# EAGLE design DIY BMSP Ver 3.0 (EAGLE 7.5.0)
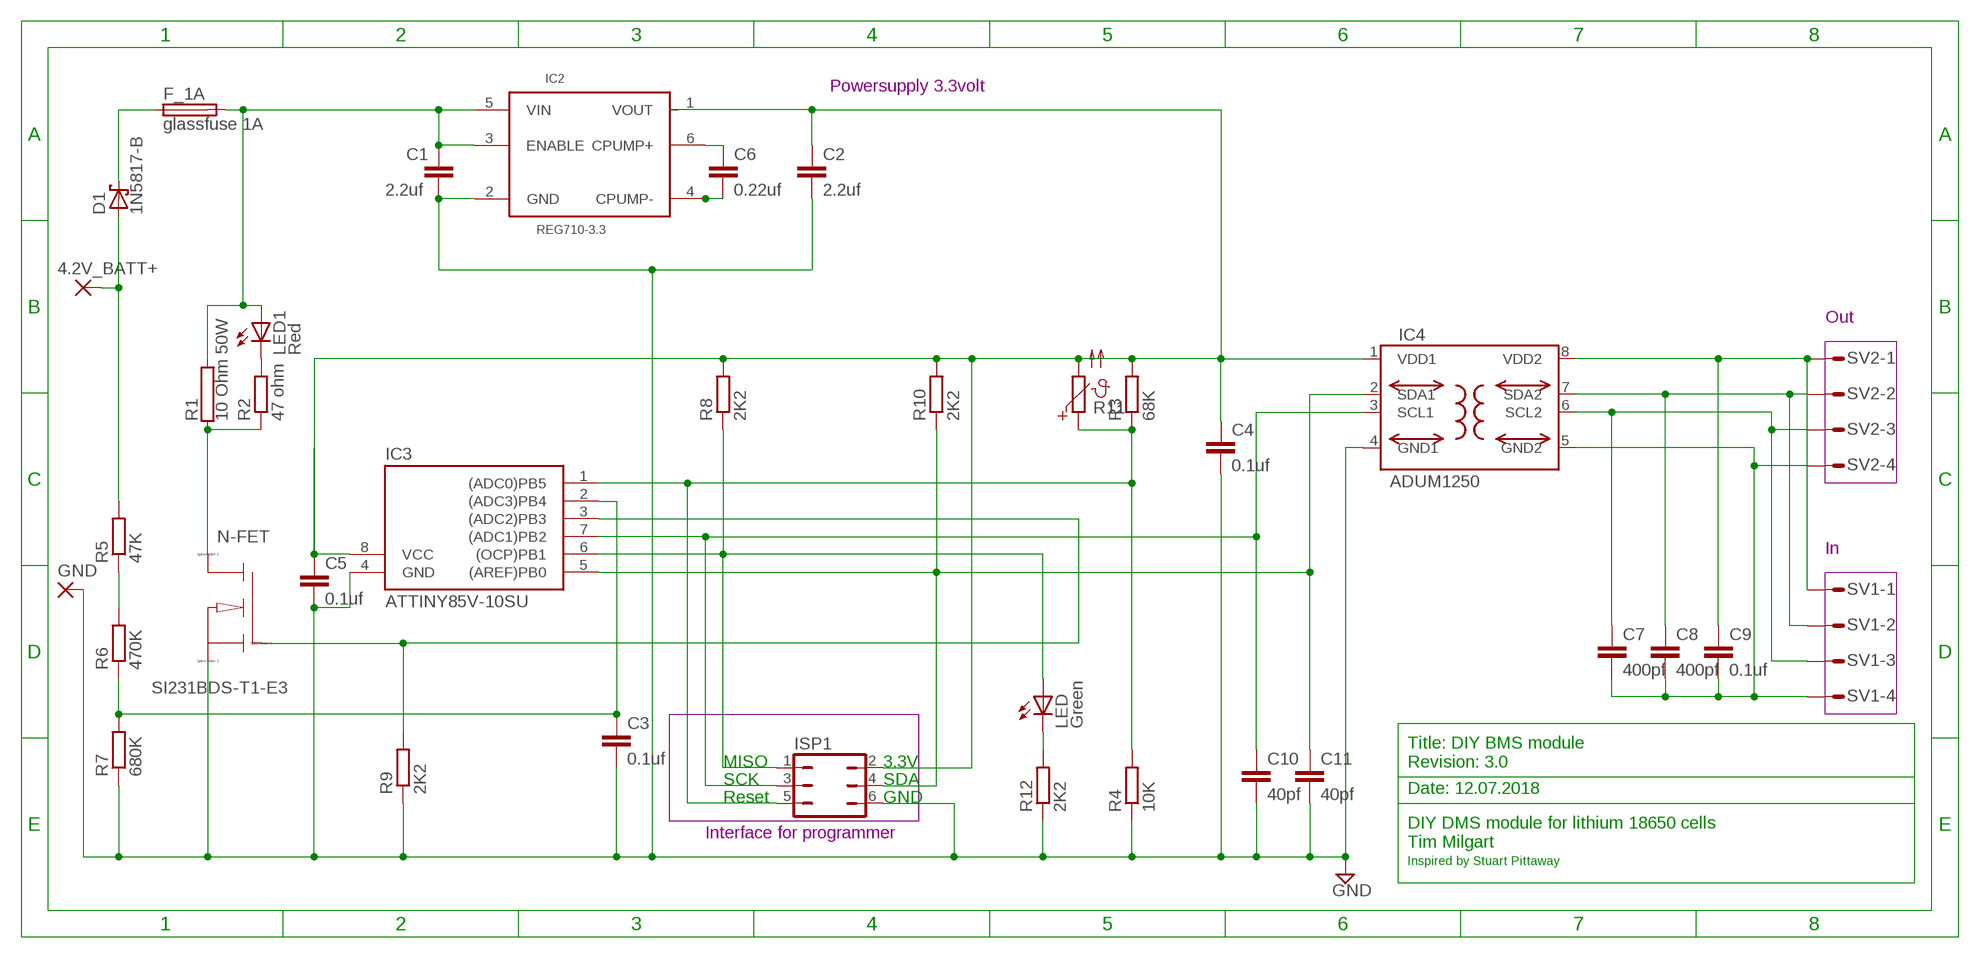
[diagram p0: schematic, sheet 1]

## Parts
4.2V_BATT+  3,17/1,3  [3,17/1,3]
C1  2.2uf  C-EU050-025X075  [C050-025X075]
C2  2.2uf  C-EU050-025X075  [C050-025X075]
C3  0.1uf  C-EU050-025X075  [C050-025X075]
C4  0.1uf  C-EU050-025X075  [C050-025X075]
C5  0.1uf  C-EU050-025X075  [C050-025X075]
C6  0.22uf  C-EU050-025X075  [C050-025X075]
C7  400pf  C-EU050-024X044  [C050-024X044]
C8  400pf  C-EU050-024X044  [C050-024X044]
C9  0.1uf  C-EU050-025X075  [C050-025X075]
C10  40pf  C-EU050-024X044  [C050-024X044]
C11  40pf  C-EU050-024X044  [C050-024X044]
D1  1N5817-B  [DO41-7.6]
F_1A  glassfuse 1A  FUSEPICOFUSE  [PICOFUSE]
GND  3,17/1,3  [3,17/1,3]
IC2  REG710-3.3  REG710NA(SOT23-6)  [SOT-23-6]
IC3  ATTINY85V-10SU  TINY15LP  [DIL08]
IC4  ADUM1250  [SO8-COOL]
ISP1  JP3Q  [JP3Q]
LED  Green  TLLG4400  [LED3MM]
LED1  Red  TLLG4400  [LED3MM]
N-FET  SI231BDS-T1-E3  NMOS  [SOT23]
R1  10 Ohm 50W  RHPS947  [HPS947]
R2  47 ohm  R-EU_0207/10  [0207/10]
R3  68K  R-EU_0207/10  [0207/10]
R4  10K  R-EU_0207/10  [0207/10]
R5  47K  R-EU_0207/10  [0207/10]
R6  470K  R-EU_0207/10  [0207/10]
R7  680K  R-EU_0207/10  [0207/10]
R8  2K2  R-EU_0207/10  [0207/10]
R9  2K2  R-EU_0207/10  [0207/10]
R10  2K2  R-EU_0207/10  [0207/10]
R11  PTC679  [P679]
R12  2K2  R-EU_0207/10  [0207/10]
SV1  L04P  [L04P]
SV2  L04P  [L04P]

## Nets
GND1: C1.2 C2.2 C3.2 C4.2 C5.2 C10.2 C11.2 GND.1(P) IC3.4(GND) IC4.4(GND1) ISP1.6 N-FET.2(S) R4.1 R7.1 R9.1 R12.1 ; supply symbol labelled GND
GND2: C7.2 C8.2 C9.2 IC4.5(GND2) SV1.4 SV2.4
N$1: 4.2V_BATT+.1(P) D1.A R5.2
N$4: D1.C F_1A.1
N$5: C8.1 IC4.7(SDA2) SV1.2 SV2.2
N$6: C6.1 IC2.6(CPUMP+)
N$7: C7.1 IC4.6(SCL2) SV1.3 SV2.3
N$9: IC3.3((ADC2)PB3) N-FET.1(G) R9.2
N$10: LED.K(C) R12.2
N$11: C10.1 IC3.7((ADC1)PB2) IC4.3(SCL1) ISP1.3
N$12: C3.1 IC3.2((ADC3)PB4) R6.1 R7.2
N$13: C11.1 IC3.5((AREF)PB0) IC4.2(SDA1) ISP1.4 R10.1
N$14: R5.1 R6.2
N$15: C6.2 IC2.4(CPUMP-)
N$16: IC3.6((OCP)PB1) ISP1.1 LED.A R8.1
N$17: IC3.1((ADC0)PB5) ISP1.5 R3.1 R4.2 R11.1
N$47: N-FET.3(D) R1.1 R2.1
N$52: LED1.K(C) R2.2
N$53: C1.1 F_1A.2 IC2.3(ENABLE) IC2.5(VIN) LED1.A R1.2
VDD1: C2.1 C4.1 C5.1 IC3.8(VCC) IC4.1(VDD1) ISP1.2 R3.2 R8.2 R10.2 R11.2
VDD2: C9.1 IC4.8(VDD2) SV1.1 SV2.1
Unconnected: IC2.1(VOUT)

## Notes on the sheet
- Powersupply 3.3volt
- Out
- In
- MISO | 3.3V
- Title: DIY BMS module
  Revision: 3.0
- SCK | SDA
- Date: 12.07.2018
- Reset | GND
- Interface for programmer
- DIY DMS module for lithium 18650 cells
  Tim Milgart
- Inspired by Stuart Pittaway

## Power pins joined to a net without a drawn wire
GND1: IC2.2(GND)

## Library data of the parts
4.2V_BATT+ GND = wirepad:3,17/1,3: THROUGH-HOLE PAD
C1-C11 = rcl:C-EU: CAPACITOR, European symbol
D1 = diode:1N581*: 1.0A SCHOTTKY BARRIER RECTIFIER Source: http://www.diodes.com/datasheets/ds23001.pdf
F_1A = fuse:FUSE: Fuse; OC_FARNELL: unknown; OC_NEWARK: unknown
IC2 = Tim-ic2:REG710NA(SOT23-6): 3100302999; MPN: REG710NA
IC3 = atmel:TINY15L: MICROCONTROLLER 2.7 V 1 Kbytes FLASH 64 bytes EEPROM 4-channel 10 bit ADC; OC_FARNELL: unknown; OC_NEWARK: unknown
IC4 = analog-devices-3:ADUM1250: Hot Swappable, Dual I2C Isolators Source: http://www.analog.com/static/imported-files/data_sheets/ADUM1250_1251.pdf
ISP1 = jumper:JP3Q: JUMPER
LED LED1 = led:TLLG4400: Low Current (2mA) LED 3 mm Tinted Diffused Package color GREEN Source: Data sheet <http://www.farnell.com/datasheets/391098.pdf>; MF: VISHAY SEMICONDUCTOR; OC_FARNELL: 1612435
N-FET = sym:NMOS: N-Channel MOSFET transistor
R1 = resistor-power:R: Power Resitor; OC_FARNELL: unknown; OC_NEWARK: unknown
R2-R10 R12 = rcl:R-EU_: RESISTOR, European symbol
R11 = ptc-ntc:PTC679: PHILIPS PTC; OC_FARNELL: unknown; OC_NEWARK: unknown
SV1 SV2 = con-amp-mt:L04P: AMP MT CONNECTOR; OC_FARNELL: unknown; OC_NEWARK: unknown

## Board
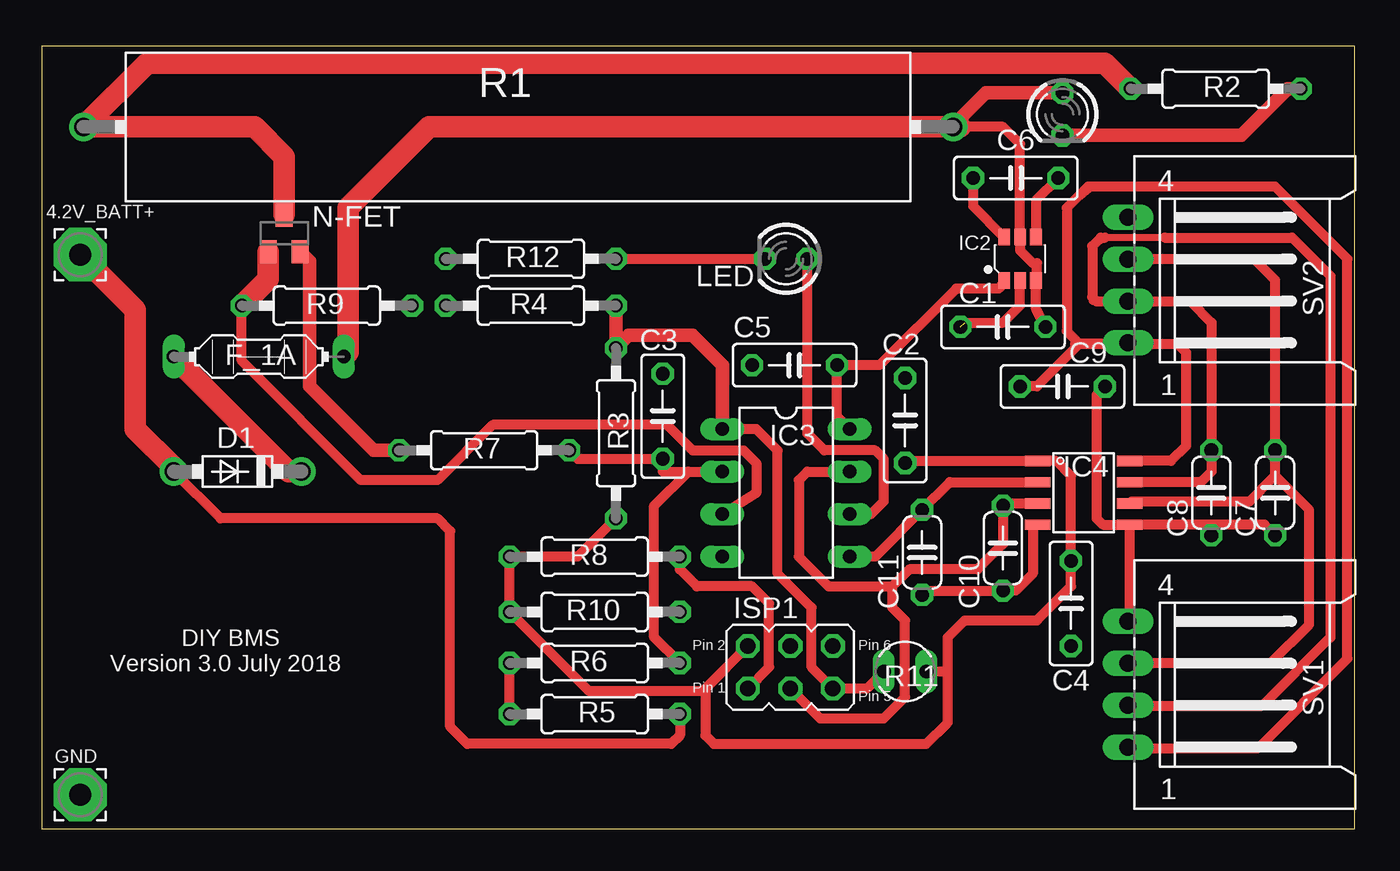
[diagram p1: board, top side]
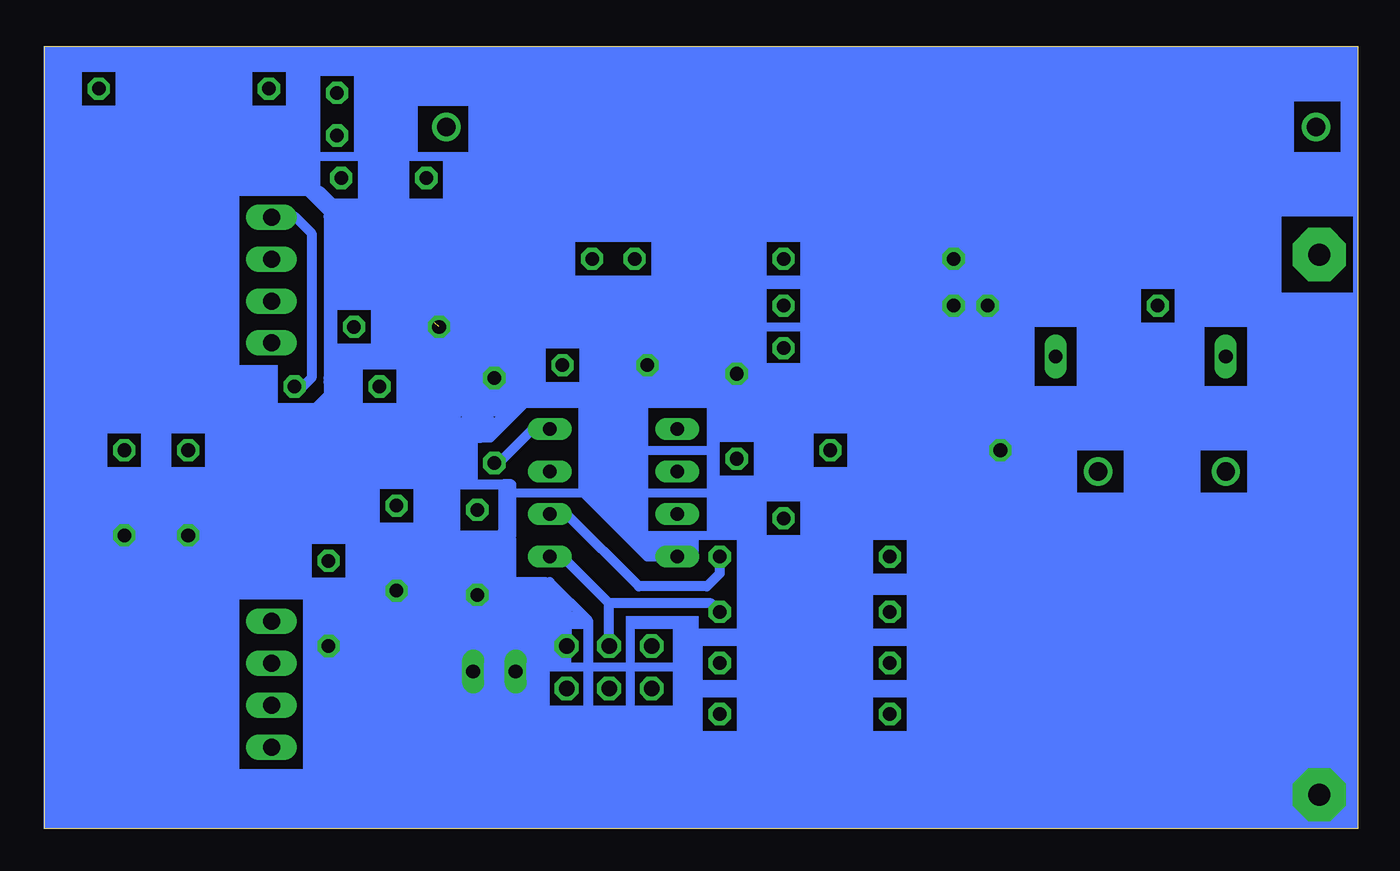
[diagram p2: board, bottom side, seen from below]

Size 78.41 x 46.73 mm. Coordinates in mm from the lower left corner, seen from the top.
Outline: 0,0 78.41,0 78.41,46.73 0,46.73 0,0
Copper layers (1*16): Top 0.035mm / dielectric 1.5mm / Bottom 0.035mm
Design rules "default": minimum track width 10mil, minimum drill 24mil, track to track 8mil, track to pad 8mil, pad to pad 8mil, via to via 8mil, smd to smd 8mil, copper to edge 40mil, drill to drill 8mil, minimum pad ring 10mil, minimum via ring 8mil, stop-mask expansion 4mil, vias tented up to drill 0mil, thermal gap 10mil

### Footprints (pad centres in the part's own frame; a part is rotated, then mirrored left to right if it is on the bottom)
3,17/1,3 = drill 1.321 pad 3.175 octagon: 1 0,0
C050-025X075 = drill 0.813 octagon: 1 -2.54,0; 2 2.54,0
C050-024X044 = drill 0.813 octagon: 1 -2.54,0; 2 2.54,0
DO41-7.6 = drill 1.1 pad 1.7: A 3.81,0; C -3.81,0
PICOFUSE = drill 0.813 long: 1 -5.08,0; 2 5.08,0
SOT-23-6 = smd 0.69 x 1: 1 -0.95,-1.3; 2 0,-1.3; 3 0.95,-1.3; 4 0.95,1.3; 5 0,1.3; 6 -0.95,1.3
DIL08 = drill 0.813 long: 1 -3.81,-3.81; 2 -1.27,-3.81; 3 1.27,-3.81; 4 3.81,-3.81; 5 3.81,3.81; 6 1.27,3.81; 7 -1.27,3.81; 8 -3.81,3.81
SO8-COOL = smd 0.61 x 1.524: 1 -1.905,-2.743; 2 -0.635,-2.743; 3 0.635,-2.743; 4 1.905,-2.743; 5 1.905,2.743; 6 0.635,2.743; 7 -0.635,2.743; 8 -1.905,2.743
JP3Q = drill 0.914 octagon: 1 -2.54,-1.27; 2 -2.54,1.27; 3 0,-1.27; 4 0,1.27; 5 2.54,-1.27; 6 2.54,1.27
LED3MM = drill 0.813 octagon: A -1.27,0; K 1.27,0
SOT23 = smd 1 x 1.4: 1 -0.95,-1.1; 2 0.95,-1.1; 3 0,1.1
HPS947 = drill 1.1 pad 1.7: 1 -25.97,0; 2 25.97,0
0207/10 = drill 0.813 octagon: 1 -5.08,0; 2 5.08,0
P679 = drill 0.813 long: 1 -1.27,0; 2 1.27,0
L04P = drill 1.016 long: 1 3.75,-6.25; 2 1.25,-6.25; 3 -1.25,-6.25; 4 -3.75,-6.25

### Placement (x,y rotation side)
4.2V_BATT+  2.29,34.29 0 top
C1  57.4,29.97 180 top
C2  51.56,24.38 90 top
C3  37.08,24.64 90 top
C4  61.47,13.46 270 top
C5  44.96,27.69 180 top
C6  58.17,38.86 0 top
C7  73.66,20.07 270 top
C8  69.85,20.07 270 top
C9  60.96,26.42 0 top
C10  57.4,16.76 270 top
C11  52.58,16.51 270 top
D1  11.68,21.34 180 top
F_1A  12.95,28.19 0 top
GND  2.29,2.03 0 top
IC2  58.42,34.04 0 top
IC3  44.45,20.07 270 top
IC4  62.23,20.07 270 top
ISP1  44.7,9.65 0 top
LED  44.45,34.04 180 top
LED1  60.96,42.67 270 top
N-FET  14.48,35.56 0 top
R1  28.45,41.91 0 top
R2  70.1,44.2 0 top
R3  34.29,23.62 270 top
R4  29.21,31.24 0 top
R5  33.02,6.86 0 top
R6  33.02,9.91 180 top
R7  26.42,22.61 0 top
R8  33.02,16.26 180 top
R9  17.02,31.24 180 top
R10  33.02,12.95 180 top
R11  51.56,9.4 0 top
R12  29.21,34.04 0 top
SV1  71.12,8.64 270 top
SV2  71.12,32.77 270 top

### Tracks (layer width: path | path; a pad name or v marks a point on that pad's centre or on a via)
GND1  (1 unrouted)
  Top 0.61: 55.12,30.23 57.4,30.23 58.42,31.24 IC2.2 | C11.2 52.83,14.22 C10.2 58.17,14.22 59.18,15.24 59.18,18.16 IC4.4
  Top 0.813: N-FET.2 16,33.89 16,26.42 19.81,22.61 R7.1
  Bottom 0.61: C3.2 40.89,29.21 C5.2 42.93,27.69 43.18,27.43 | IC3.4 42.42,16.26 42.67,16.51 | 42.67,16.51 43.18,17.02 | 43.18,17.02 43.18,27.43 | 43.18,27.43 45.47,29.72 52.32,29.72 52.58,29.97 C1.2 | C10.2 58.17,14.22 C4.2 61.47,13.97 61.98,14.48 63.5,14.48 63.75,14.73 63.75,17.53 63.5,17.78 61.98,17.78 61.47,18.29 61.47,23.37 54.36,23.37 53.85,23.88 | 43.18,17.02 45.97,19.81 | 45.97,19.81 45.97,20.07 45.72,19.81 45.21,19.81 | 45.21,19.81 45.72,20.32 45.72,25.91 51.56,25.91 | 51.56,25.91 51.82,25.91 53.85,23.88 | 42.67,25.65 42.67,16.51 | 45.97,19.81 46.23,20.07 46.23,25.4 | 43.94,18.54 45.21,19.81 | 45.21,19.81 45.21,20.32 43.94,19.05 | 42.67,20.07 42.67,16.76 43.94,18.03 43.94,19.05 | 43.94,19.05 43.69,19.05 43.43,18.8 43.43,18.03 | 43.94,19.05 43.69,19.3 43.69,19.81 44.2,19.81 | C2.2 51.56,25.91 | ISP1.6 52.58,10.92 C11.2 | 47.24,12.7 47.24,13.46 48.51,14.73 | 47.24,12.45 47.24,11.18 | 47.24,11.18 ISP1.6 | ISP1.6 47.75,11.43 47.75,13.46 48.51,14.22 48.51,11.43 48.26,11.43 48.01,11.68 48.01,13.46 | 47.24,11.18 49.02,9.4 | ISP1.6 49.28,8.89 | 48.51,14.73 50.55,14.73 50.55,17.27 53.85,17.27 53.85,17.53 50.55,17.53 50.55,20.57 51.05,20.57 | 53.85,20.57 51.05,20.57 | 51.05,20.57 51.05,17.78 | 48.51,14.73 48.26,14.73 45.97,12.45 45.97,7.11 | 46.23,12.45 47.24,12.45 | 47.24,12.45 47.24,12.7 | 47.24,12.7 46.74,12.7 | 52.07,24.38 53.34,23.11 53.09,23.11 52.83,23.37 | 52.83,23.37 51.82,24.38 | 49.53,25.65 51.82,23.37 52.32,23.37 | 52.83,23.37 52.32,23.37 | 52.32,23.37 50.8,24.89 50.8,25.15 51.05,24.89 52.58,24.89 | 52.58,24.89 53.34,24.13 53.09,23.88 52.83,23.88 52.32,24.38 52.32,24.64 52.58,24.89 | 52.58,24.89 54.1,24.89 54.36,24.64 54.36,24.13 54.1,23.88 53.85,23.88
  Bottom 0.61: 53.85,23.88 53.85,24.64
  Bottom 0.813: GND.1 17.02,16.76 17.02,19.81 19.81,22.61 R7.1
  Bottom 1.27: R12.1 R4.1 | R4.1 R9.1 21.34,30.48 R7.1 | C3.2 24.13,27.18 R4.1
GND2
  Top 0.61: C7.2 73.03,18.16 IC4.5 | 63.25,26.42 C9.2 62.99,25.91 62.99,18.54 63.37,18.16 IC4.5 | SV1.4 64.97,12.49 IC4.5
  Bottom 0.61: SV2.4 64.81,36.58 63.5,36.58 62.48,35.56 62.48,26.92 62.99,26.42 C9.2
  Bottom 1.27: C8.2 C7.2
N$1
  Top 0.61: R5.2 38.1,5.59 37.59,5.08 25.4,5.08 24.38,6.1 24.38,17.78 23.62,18.54 10.67,18.54 D1.A
  Top 1.27: 4.2V_BATT+.1 5.59,30.99 5.59,23.88 7.87,21.59 D1.A
N$4
  Top 1.27: F_1A.1 14.73,21.34 D1.C
N$5
  Top 0.406: 67.06,35.31 63.5,35.31 62.74,34.8 | 62.74,31.75 62.72,31.52 SV2.2
  Top 0.61: IC4.7 69.22,20.7 69.85,21.34 C8.1 69.85,30.23 68.58,31.5 64.89,31.5 SV2.2 | SV1.2 64.89,7.37 72.9,7.37 76.96,11.43 76.96,33.02 74.68,35.31 67.06,35.31 | 64.77,31.5 62.99,31.5 62.74,31.75 62.74,34.8 63.25,35.31 63.5,35.31
N$6
  Top 0.61: IC2.6 55.63,37.18 C6.1
N$7
  Top 0.406: 75.69,19.05 73.79,20.95 73.53,20.95
  Top 0.61: IC4.6 65.1,19.56 72.14,19.56 73.53,20.95 73.66,21.08 | SV2.3 72.41,34.02 73.66,32.77 C7.1 73.66,21.59 73.66,21.08 | SV1.3 64.89,9.91 73.41,9.91 75.69,12.19 75.69,19.05 73.66,21.08
N$9
  Top 0.61: 40.89,19.05 IC3.3 42.67,20.07 42.67,21.84 41.91,22.61 38.86,22.61 37.34,24.13 26.92,24.13 23.62,20.83 19.05,20.83 11.94,27.94 R9.2
  Top 1.27: R9.2 13.53,32.83 N-FET.1
N$10
  Top 0.61: R12.2 LED.K
N$11
  Top 0.61: IC3.7 45.72,21.34 45.21,20.83 45.21,16.26 46.99,14.48 50.8,14.48 | 50.8,14.48 51.82,15.49 55.88,15.49 57.4,17.02 C10.1 57.53,19.43 IC4.3 | ISP1.3 46.48,6.6 50.29,6.6 51.56,7.87 51.56,12.45 50.8,13.21 50.8,14.48
N$12
  Top 0.61: 38.61,21.34 37.08,21.34 C3.1 32,22.1 R7.2 | 38.61,21.34 IC3.2 | R6.1 36.58,11.43 36.58,19.3 38.61,21.34
N$13
  Top 0.61: IC3.5 49.78,16.26 C11.1 54.23,20.7 IC4.2
  Bottom 0.61: R10.1 38.61,13.46 44.7,13.46 | 44.7,13.46 47.5,16.26 IC3.5 | ISP1.4 44.7,13.46
N$14
  Top 0.61: R5.1 R6.2
N$15
  Top 0.61: C6.2 59.37,37.53 IC2.4
N$16
  Top 0.61: IC3.6 49.53,18.8 50.29,19.56 50.29,22.1 49.78,22.61 46.74,22.61 45.72,23.62 LED.A | ISP1.1 43.43,9.65 43.43,13.46 42.42,14.48 39.12,14.48 38.1,15.49 R8.1
  Bottom 0.61: R8.1 38.1,15.24 38.86,14.48 42.93,14.48 47.24,18.8 IC3.6
N$17
  Top 0.61: IC3.1 42.67,23.88 43.94,22.61 43.94,15.24 45.97,13.21 45.97,9.65 ISP1.5 49.28,8.38 R11.1
  Top 0.813: R4.2 R3.1 35.05,29.46 38.86,29.46 40.64,27.69 IC3.1
N$18
  Bottom 0.61: 68.07,38.1 62.74,38.1 | 62.74,38.1 61.98,38.1 60.71,36.83 60.96,36.83 61.47,37.34 | 61.47,37.34 62.48,38.35 62.74,38.35 62.74,38.1 | 62.74,38.1 60.71,36.07 | 54.36,37.34 61.47,37.34
N$19
  Bottom 0.61: 61.47,26.92 61.21,27.18 61.21,36.83 61.47,36.58 61.47,26.92 | 61.47,26.92 61.47,26.67 61.47,24.89
N$20
  Bottom 0.61: 61.21,26.16 62.48,24.89
N$47
  Top 1.27: R2.1 63.5,45.72 6.29,45.72 R1.1 12.7,41.91 14.48,40.13 N-FET.3
N$52
  Top 0.813: LED1.K 71.63,41.4 74.42,44.2 R2.2
N$53
  Top 0.61: R1.2 57.4,41.91 58.42,40.89 IC2.5 58.42,34.54 59.18,33.78 59.44,33.78 59.44,32.8 IC2.3 59.37,31.05 C1.1
  Top 0.813: LED1.A 56.39,43.94 54.42,41.97 R1.2
  Top 1.27: 54.86,41.91 R1.2 23.11,41.91 18.29,37.08 18.29,28.45 F_1A.2
VDD1
  Top 0.406: 54.1,7.11 54.1,6.6
  Top 0.61: IC3.8 47.5,24.64 C5.1 50.04,27.69 54.61,32.26 57.15,32.26 57.4,32.51 | C2.1 51.69,21.97 IC4.1 60.58,21.97 61.47,21.08 C4.1 61.47,14.48 59.44,12.45 55.12,12.45 54.1,11.43 54.1,9.4 | 54.1,9.4 54.1,6.6 54.1,6.35 52.83,5.08 40.13,5.08 39.62,5.59 39.62,8.38 ISP1.2 39.5,8.26 32.64,8.26 R10.2 R8.2 32,16.26 R3.2 | R11.2 54.1,9.4
  Bottom 0.61: IC3.8 49.28,23.88 51.31,21.84 C2.1
VDD2
  Top 0.406: 62.74,38.35 61.21,37.08 | SV2.1 63.69,29.02 63.63,28.96 61.98,28.96 61.21,29.72
  Top 0.61: SV1.1 64.93,4.83 72.64,4.83 77.98,10.16 77.98,34.04 73.66,38.35 62.74,38.35 62.48,38.35 61.21,37.08 61.21,29.72 61.72,29.21 61.72,28.96 65.02,28.96 | SV2.1 64.93,28.96 | 64.93,28.96 64.97,28.91 65.02,28.96 | 64.93,28.96 61.98,28.96 59.44,26.42 C9.1 | 65.02,28.96 67.82,28.96 68.33,28.45 68.33,22.86 67.44,21.97 IC4.8
(copper drawn outside any net)
  shapes: Bottom area x166

### Text on the board
tPlace: Pin 2 | Pin 6 | DIY BMS / Version 3.0 July 2018 | Pin 1 | Pin 5